# Altium project Final Project.PrjPCB
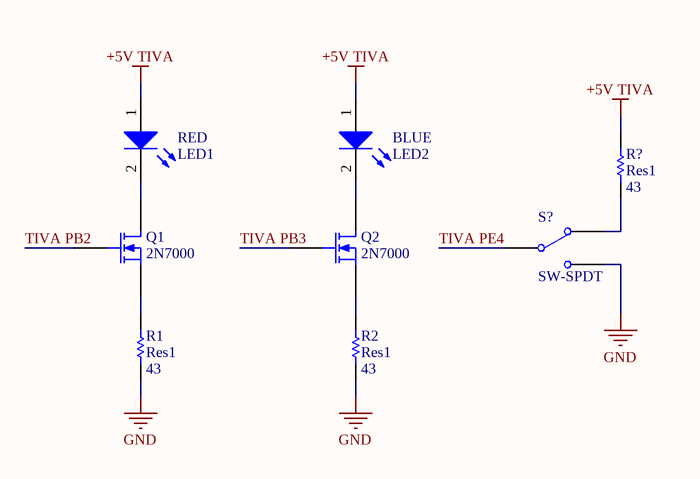
[diagram p0: Corporate LED.SchDoc]
3 sheets, 17 parts. Net scope: global (net labels, ports and power ports of the same name join across sheets).
Sheets:
  Corporate LED.SchDoc
  Electromagnet.SchDoc
  Power Distribution.SchDoc

## Sheet Corporate LED.SchDoc
size A

### Parts
(Parts that share a designator on the sheet are numbered #1, #2 ... from top to bottom, then left to right.)
BLUE  LED2  [LED-1]
Q1#1  2N7000  [BCY-W3/D5]
Q2  2N7000  [BCY-W3/D5]
R1  Res1  value 43  [AXIAL-0.3]
R2  Res1  value 43  [AXIAL-0.3]
R?#1  Res1  value 43  [AXIAL-0.3]
RED#1  LED1  [LED-1]
S?  SW-SPDT  [SPDT-3]

### Nets
+5V TIVA: BLUE.1(A) R?#1.2 RED#1.1(A)
GND: R1.1 R2.1 S?.3(NO)
TIVA PB2: Q1#1.2(G)
TIVA PB3: Q2.2(G)
TIVA PE4: S?.1(COMMON)
NetBLUE_2: BLUE.2(K) Q2.3(D)
NetQ1#1_1: Q1#1.1(S) R1.2
NetQ1#1_3: Q1#1.3(D) RED#1.2(K)
NetQ2_1: Q2.1(S) R2.2
NetR?#1_1: R?#1.1 S?.2(NC)

### Library data of the parts
BLUE RED#1 = LED1: Typical RED GaAs LED; Manufacturer: Generic Components; Class: Optoelectronic; Published: 08/06/2000; Publisher: Altium Hobart Technology Centre; SubClass: LED
Q1#1 Q2 = 2N7000: N-Channel Enhancement Mode Vertical DMOS FET; Manufacturer: Zetex; Class: Discrete; SubClass: MOSFET - Low Power; Published: 8/06/2000; Publisher: Altium Hobart Technology Centre
R1 R2 R?#1 = Res1: Resistor; Manufacturer: Generic Components; Class: Passive; Published: 08/06/2000; Publisher: Altium Hobart Technology Centre; SubClass: Resistor
S? = SW-SPDT: Single-Pole, Double-Throw Switch; Manufacturer: Generic Components; Published: 1999

## Sheet Electromagnet.SchDoc
size A
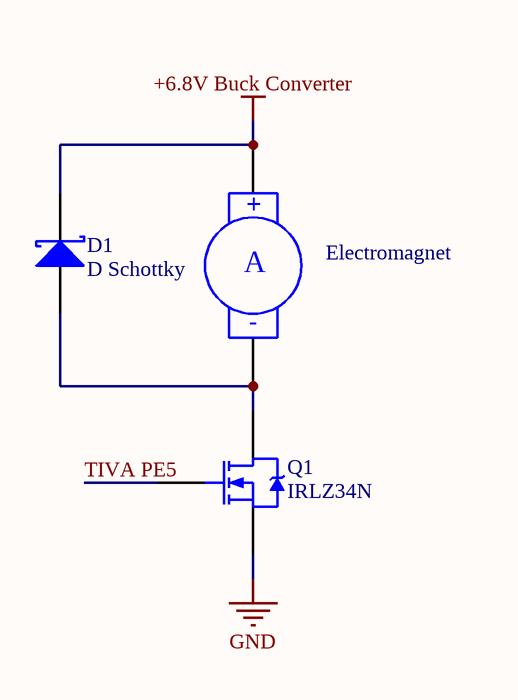
[diagram p1: Electromagnet.SchDoc]

### Parts
(Parts that share a designator on the sheet are numbered #1, #2 ... from top to bottom, then left to right.)
B?  Electromagnet  [RAD-0.4]
D1  D Schottky  [DSO-C2/X2.3]
Q1#2  IRLZ34N  [SFM-T3/A4.7V]

### Nets
+6.8V Buck Converter: B?.1(+) D1.2(K)
GND: Q1#2.3(S)
TIVA PE5: Q1#2.1(G)
NetB?_2: B?.2(-) D1.1(A) Q1#2.2(D)

### Notes on the sheet
- (in symbol Motor Servo) A

### Library data of the parts
B? = Motor Servo: Servo Motor; Manufacturer: Generic Components; Published: 1999
D1 = D Schottky: Schottky Diode; Manufacturer: Generic Components; Class: Discrete; SubClass: Diode - Schottky; Published: 08/06/2000; Publisher: Altium Hobart Technology Centre
Q1#2 = IRLZ34N: HEXFET Power MOSFET; Manufacturer: International Rectifier; Class: Discrete; SubClass: MOSFET - Power; Note: Pin 2 is electrically connected to pin 4.; Published: 8/06/2000; Publisher: Altium Hobart Technology Centre

## Sheet Power Distribution.SchDoc
size A
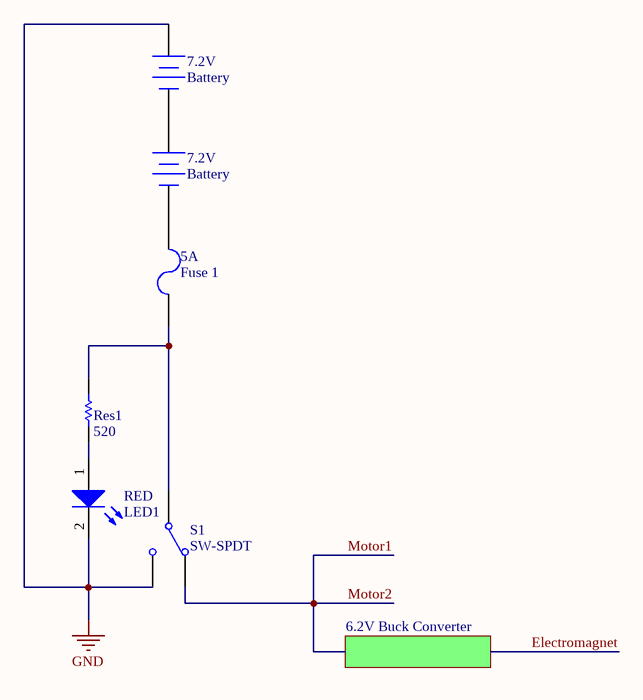
[diagram p2: Power Distribution.SchDoc]

### Parts
(Parts that share a designator on the sheet are numbered #1, #2 ... from top to bottom, then left to right.)
5A  Fuse 1  [PIN-W2/E2.8]
7.2V#1  Battery  [BAT-2]
7.2V#2  Battery  [BAT-2]
R?#2  Res1  value 520  [AXIAL-0.3]
RED#2  LED1  [LED-1]
S1  SW-SPDT  [SPDT-3]

### Sub-sheets
Designator = 6.2V Buck Converter (file not in this document): no entries

### Nets
GND: 7.2V#1.1(+) RED#2.2(K) S1.3(NO)
Motor1: S1.2(NC)  [also labelled Motor2]
Net5A_1: 5A.1 R?#2.2 S1.1(COMMON)
Net5A_2: 5A.2 7.2V#2.2(-)
Net7.2V#1_2: 7.2V#1.2(-) 7.2V#2.1(+)
NetR?#2_1: R?#2.1 RED#2.1(A)

### Library data of the parts
5A = Fuse 2: Fuse; Manufacturer: Generic Components; Class: Passive; Published: 08/06/2000; Publisher: Altium Hobart Technology Centre; SubClass: Fuse
7.2V#1 7.2V#2 = Battery: Multicell Battery; Manufacturer: Generic Components; Published: 1999
R?#2 = Res1: as R1 on sheet Corporate LED; Published: 08/06/2000; Publisher: Altium Hobart Technology Centre; SubClass: Resistor
RED#2 = LED1: as BLUE on sheet Corporate LED; Published: 08/06/2000; Publisher: Altium Hobart Technology Centre; SubClass: LED
S1 = SW-SPDT: as S? on sheet Corporate LED; Published: 1999

## Nets that join several sheets
GND: Corporate LED (R1.1 R2.1 S?.3), Electromagnet (Q1#2.3), Power Distribution (7.2V#1.1 RED#2.2 S1.3)